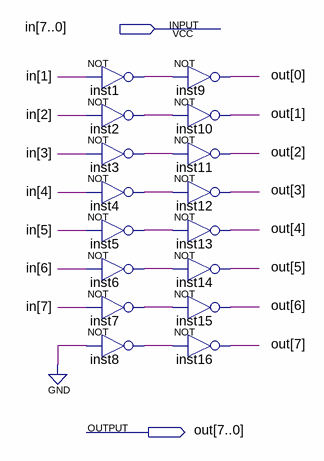
[diagram p0: schematic sheet]
// Quartus schematic SHR.bdf as structural Verilog: 16 symbols, 2 pins
module SHR (
  input  [7:0] in,
  output [7:0] out
);

  wire inst1_out, inst2_out, inst3_out, inst4_out, inst5_out, inst6_out, inst7_out, inst8_out;

  not inst1 (inst1_out, in[1]);
  not inst2 (inst2_out, in[2]);
  not inst3 (inst3_out, in[3]);
  not inst4 (inst4_out, in[4]);
  not inst5 (inst5_out, in[5]);
  not inst6 (inst6_out, in[6]);
  not inst7 (inst7_out, in[7]);
  not inst8 (inst8_out, 1'b0);
  not inst9 (out[0], inst1_out);
  not inst10 (out[1], inst2_out);
  not inst11 (out[2], inst3_out);
  not inst12 (out[3], inst4_out);
  not inst13 (out[4], inst5_out);
  not inst14 (out[5], inst6_out);
  not inst15 (out[6], inst7_out);
  not inst16 (out[7], inst8_out);
endmodule
